# EasyEDA schematic FanControl.sch.json
TITLE: FanControl; REV: 1.4; Date: 06.08.2020; Sheet: 1/1; Drawn By: Daniel Schäfer / Christian Koch; Company: SchäferServices IT-Dienstleistungen
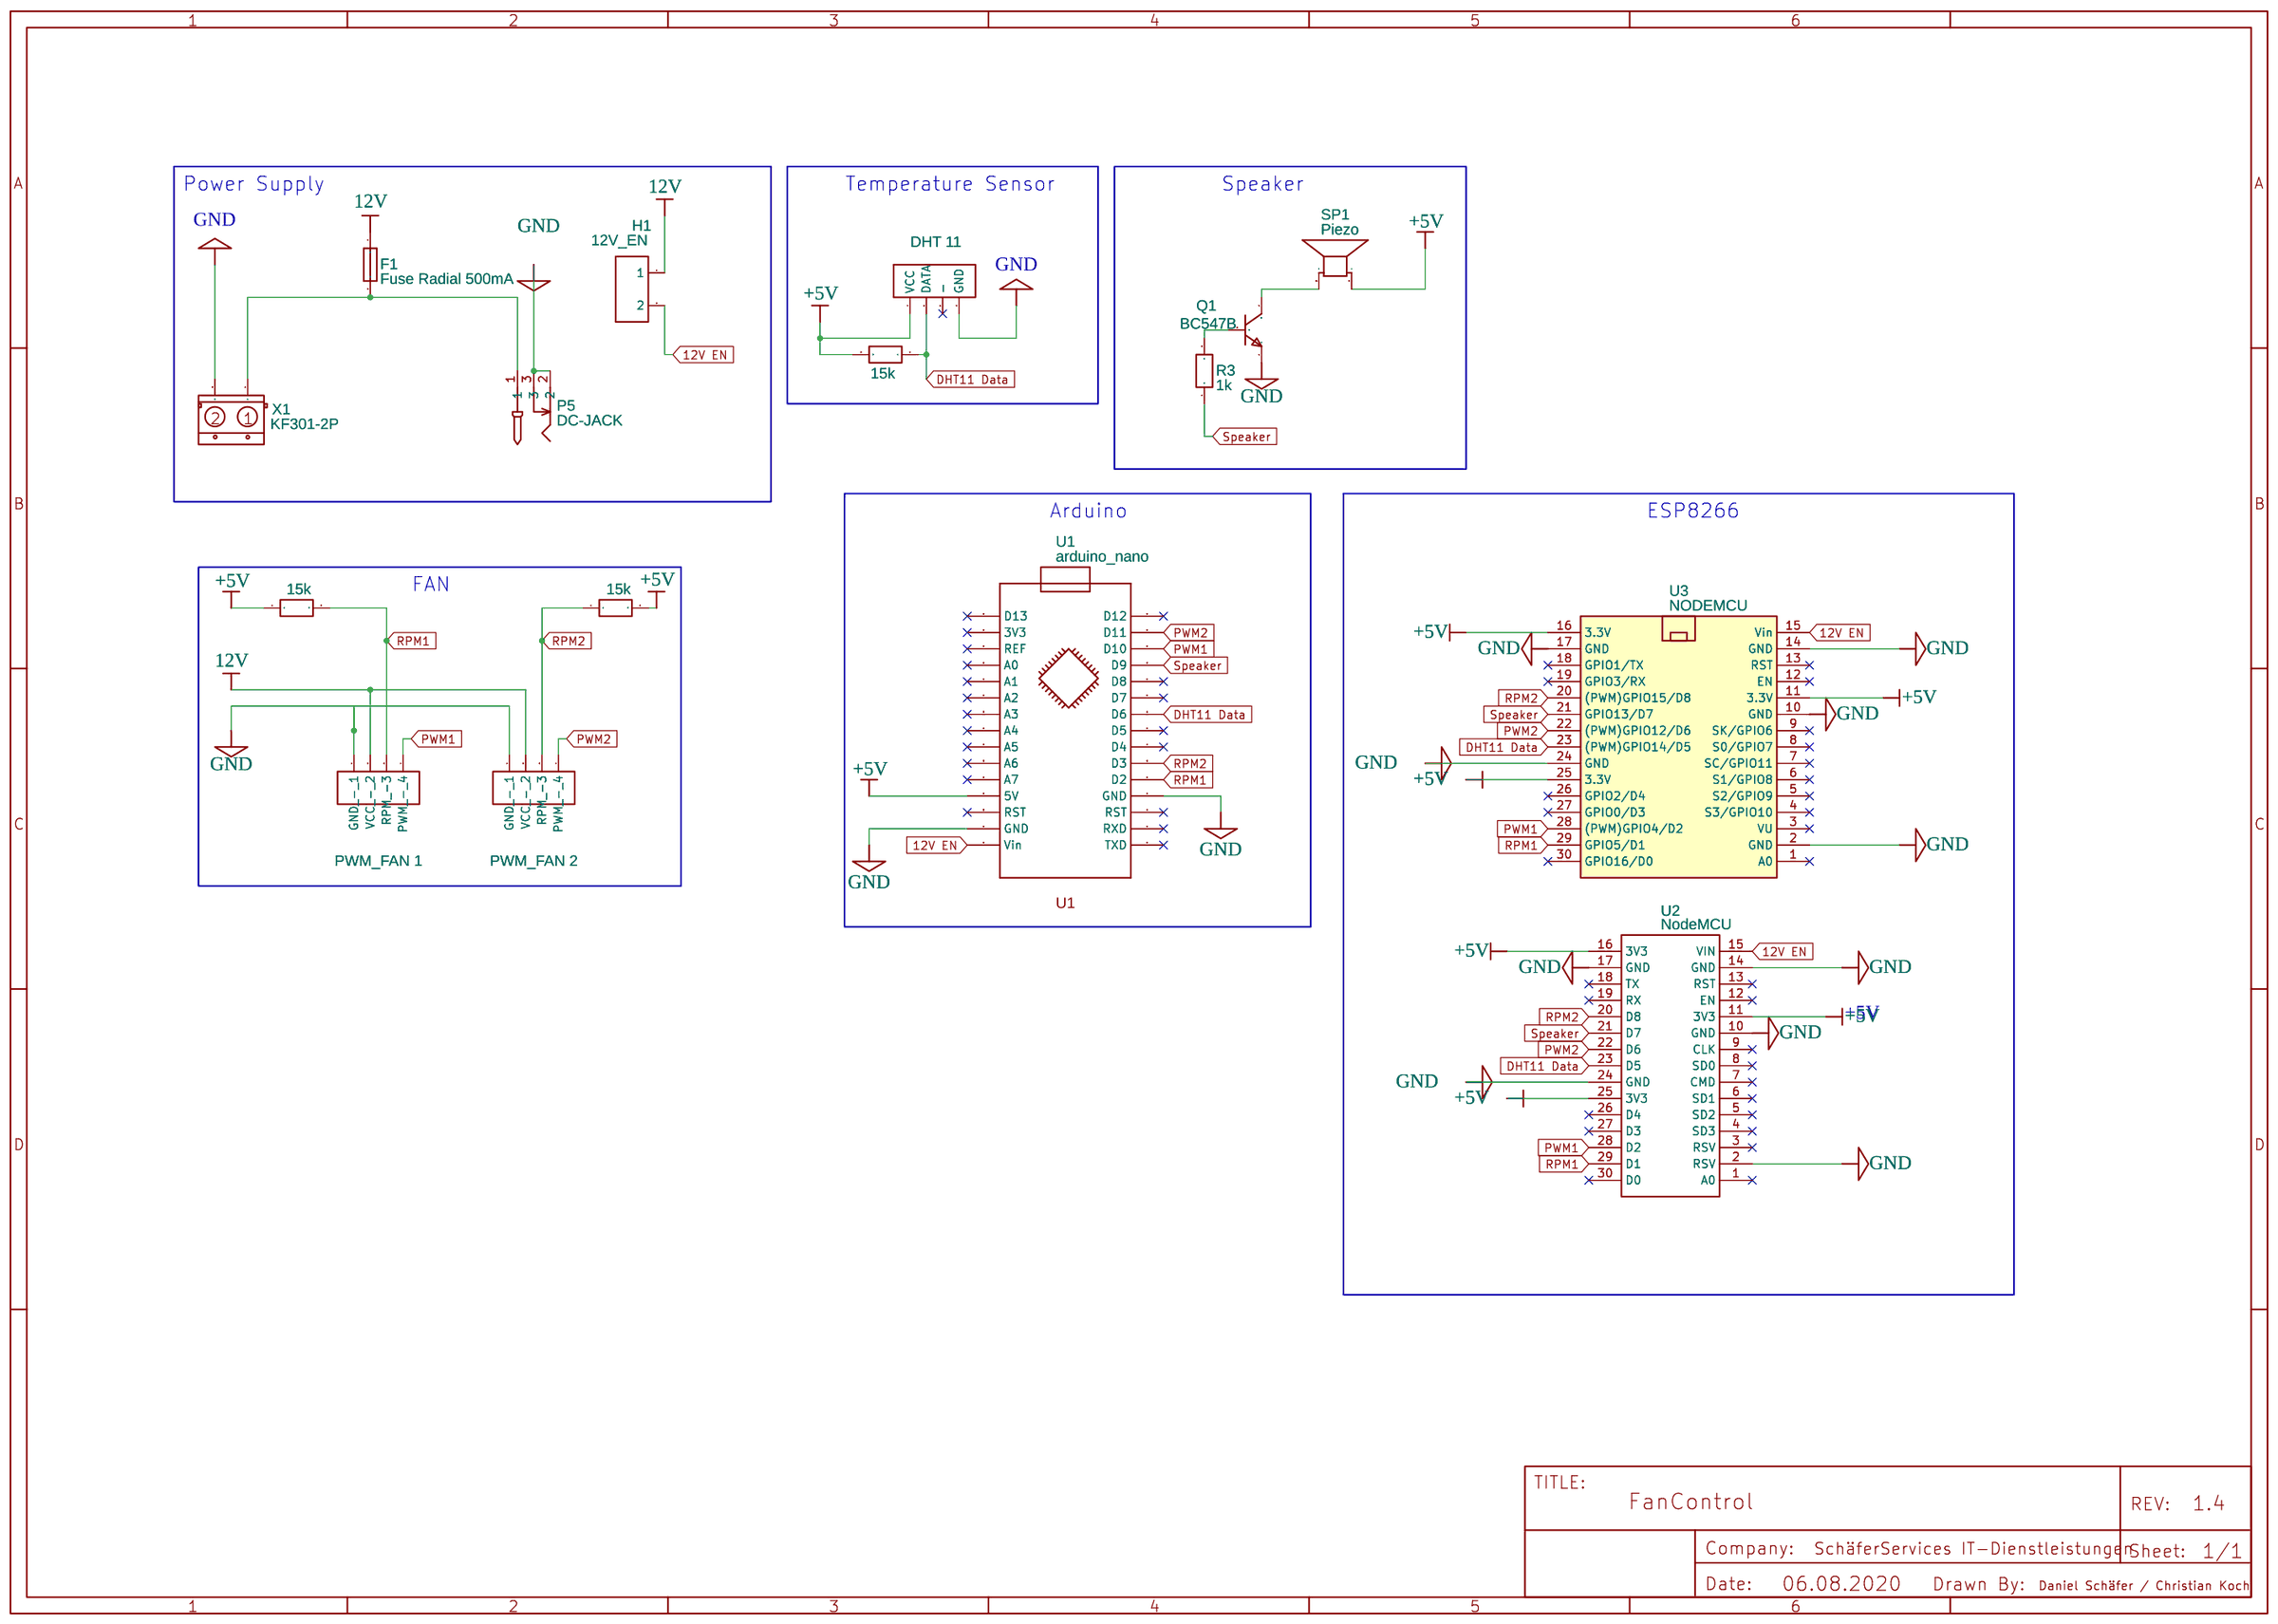
[diagram p0: schematic sheet]

## Parts
F1  Fuse Radial 500mA  [FUSE_RADIAL_8MM]
H1  12V_EN  [HDR-2X1/2.54]
P1  PWM_FAN 1  [HDR-4X1/2.54]
P2  PWM_FAN 2  [HDR-4X1/2.54]
P3  DHT 11  [HDR-4X1/2.54]
P5  DC-JACK  [DC005-2.5MM]
Q1  BC547B  [TO-92_3PIN-L4.95-W3.94-PITCH2.54-L]
R1  15k  [AXIAL-0.3]
R2  15k  [AXIAL-0.3]
R3  1k  [AXIAL-0.3]
R4  15k  [AXIAL-0.3]
SP1  Piezo  [PIEZO 12MM]
U1  arduino_nano  [ARDUINO_NANO1]
U2  NodeMCU  [NODEMCU_V2_AMICA]
U3  NODEMCU  [NODEMCU V3 LOLIN]
X1  KF301-2P  [KF301-2P]

## Library data of the parts
F1 = -: Manufacturer Part: FUSE RADIAL; Contributor: tr-dmitry
H1 = -: Supplier: LCSC; Manufacturer: TE Connectivity; Manufacturer Part: 826629-2; image: //image.lceda.cn/szlcsc/C86471.jpg; Supplier Part: C86471
P1-P3 = -: Supplier: LCSC; Manufacturer: ReliaPro; Manufacturer Part: Header-Female-2.54_1x4; Supplier Part: C124413
P5 = -: EasyEDA: E68942; Supplier Part: E68942; Supplier: EasyEDA; Manufacturer: EasyEDA
Q1 = -: Supplier: LCSC; Manufacturer: CJ; Manufacturer Part: BC547B Tube; image: //image.lceda.cn/szlcsc/C2092.jpg; Supplier Part: C2092
R1-R4 = Res_AXIAL-0.3(1/8W)_EU: Manufacturer Part: ?
SP1 = -: SPEAKER Source: BuerklinAdded PS12 (for part # PS1240 piezo) http:www.ladyada.netlibrarypcbeaglelibrary.html; Contributor: TomPilot; Supplier: Pollin
U1 = -: Manufacturer Part: arduino_nano1; Contributor: Michal Smetana
U2 = NodeMCU: Contributor: diego1.verastegui
U3 = NODEMCU: Manufacturer Part: NodeMcu V3 LoLin; Contributor: Rudiawan Edwin, M.Si, M.PKim
X1 = KF301-2P: Contributor: vonk0031; sourceId: Z5gQ20Ay7

## Nets
12V: F1.1 H1.1 P1.2(VCC - 2) P2.2(VCC - 2)
12V EN: H1.2 U1.30(Vin) U2.15(VIN) U3.15(Vin)
+5V: P3.4(VCC) R1.2 R2.2 R4.1 SP1.P$2(-) U1.27(5V) U2.11(3V3) U2.16(3V3) U2.25(3V3) U3.11(3.3V) U3.16(3.3V) U3.25(3.3V)
GND: P1.1(GND - 1) P2.1(GND - 1) P3.1(GND) P5.2 P5.3 Q1.3(E) U1.4(GND) U1.29(GND) U2.2(RSV) U2.10(GND) U2.14(GND) U2.17(GND) U2.24(GND) U3.2(GND) U3.10(GND) U3.14(GND) U3.17(GND) U3.24(GND) X1.2
DHT11 Data: P3.3(DATA) R2.1 U1.9(D6) U2.23(D5) U3.23((PWM)GPIO14/D5)
PWM1: P1.4(PWM - 4) U1.13(D10) U2.28(D2) U3.28((PWM)GPIO4/D2)
PWM2: P2.4(PWM - 4) U1.14(D11) U2.22(D6) U3.22((PWM)GPIO12/D6)
RPM1: P1.3(RPM -3) R4.2 U1.5(D2) U2.29(D1) U3.29(GPIO5/D1)
RPM2: P2.3(RPM -3) R1.1 U1.6(D3) U2.20(D8) U3.20((PWM)GPIO15/D8)
Speaker: R3.1 U1.12(D9) U2.21(D7) U3.21(GPIO13/D7)
Net-(F1-2): F1.2 P5.1 X1.1
Net-(Q1-1): Q1.1(C) SP1.P$1(+)
Net-(Q1-2): Q1.2(B) R3.2

Not connected (* = marked no-connect by the designer): P3 2(-)*; U1 1(TXD)* 2(RXD)* 3(RST)* 7(D4)* 8(D5)* 10(D7)* 11(D8)* 15(D12)* 16(D13)* 17(3V3)* 18(REF)* 19(A0)* 20(A1)* 21(A2)* 22(A3)* 23(A4)* 24(A5)* 25(A6)* 26(A7)* 28(RST)*; U2 1(A0)* 3(RSV)* 4(SD3)* 5(SD2)* 6(SD1)* 7(CMD)* 8(SD0)* 9(CLK)* 12(EN)* 13(RST)* 18(TX)* 19(RX)* 26(D4)* 27(D3)* 30(D0)*; U3 1(A0)* 3(VU)* 4(S3/GPIO10)* 5(S2/GPIO9)* 6(S1/GPIO8)* 7(SC/GPIO11)* 8(S0/GPIO7)* 9(SK/GPIO6)* 12(EN)* 13(RST)* 18(GPIO1/TX)* 19(GPIO3/RX)* 26(GPIO2/D4)* 27(GPIO0/D3)* 30(GPIO16/D0)*

## Notes on the sheet
- Power Supply
- Temperature Sensor
- Speaker
- Arduino
- ESP8266
- FAN
- +5V
